# Altium schematic sheet Main.SchDoc
size 381 x 241 mm; SheetNumber: 1; SheetTotal: 13
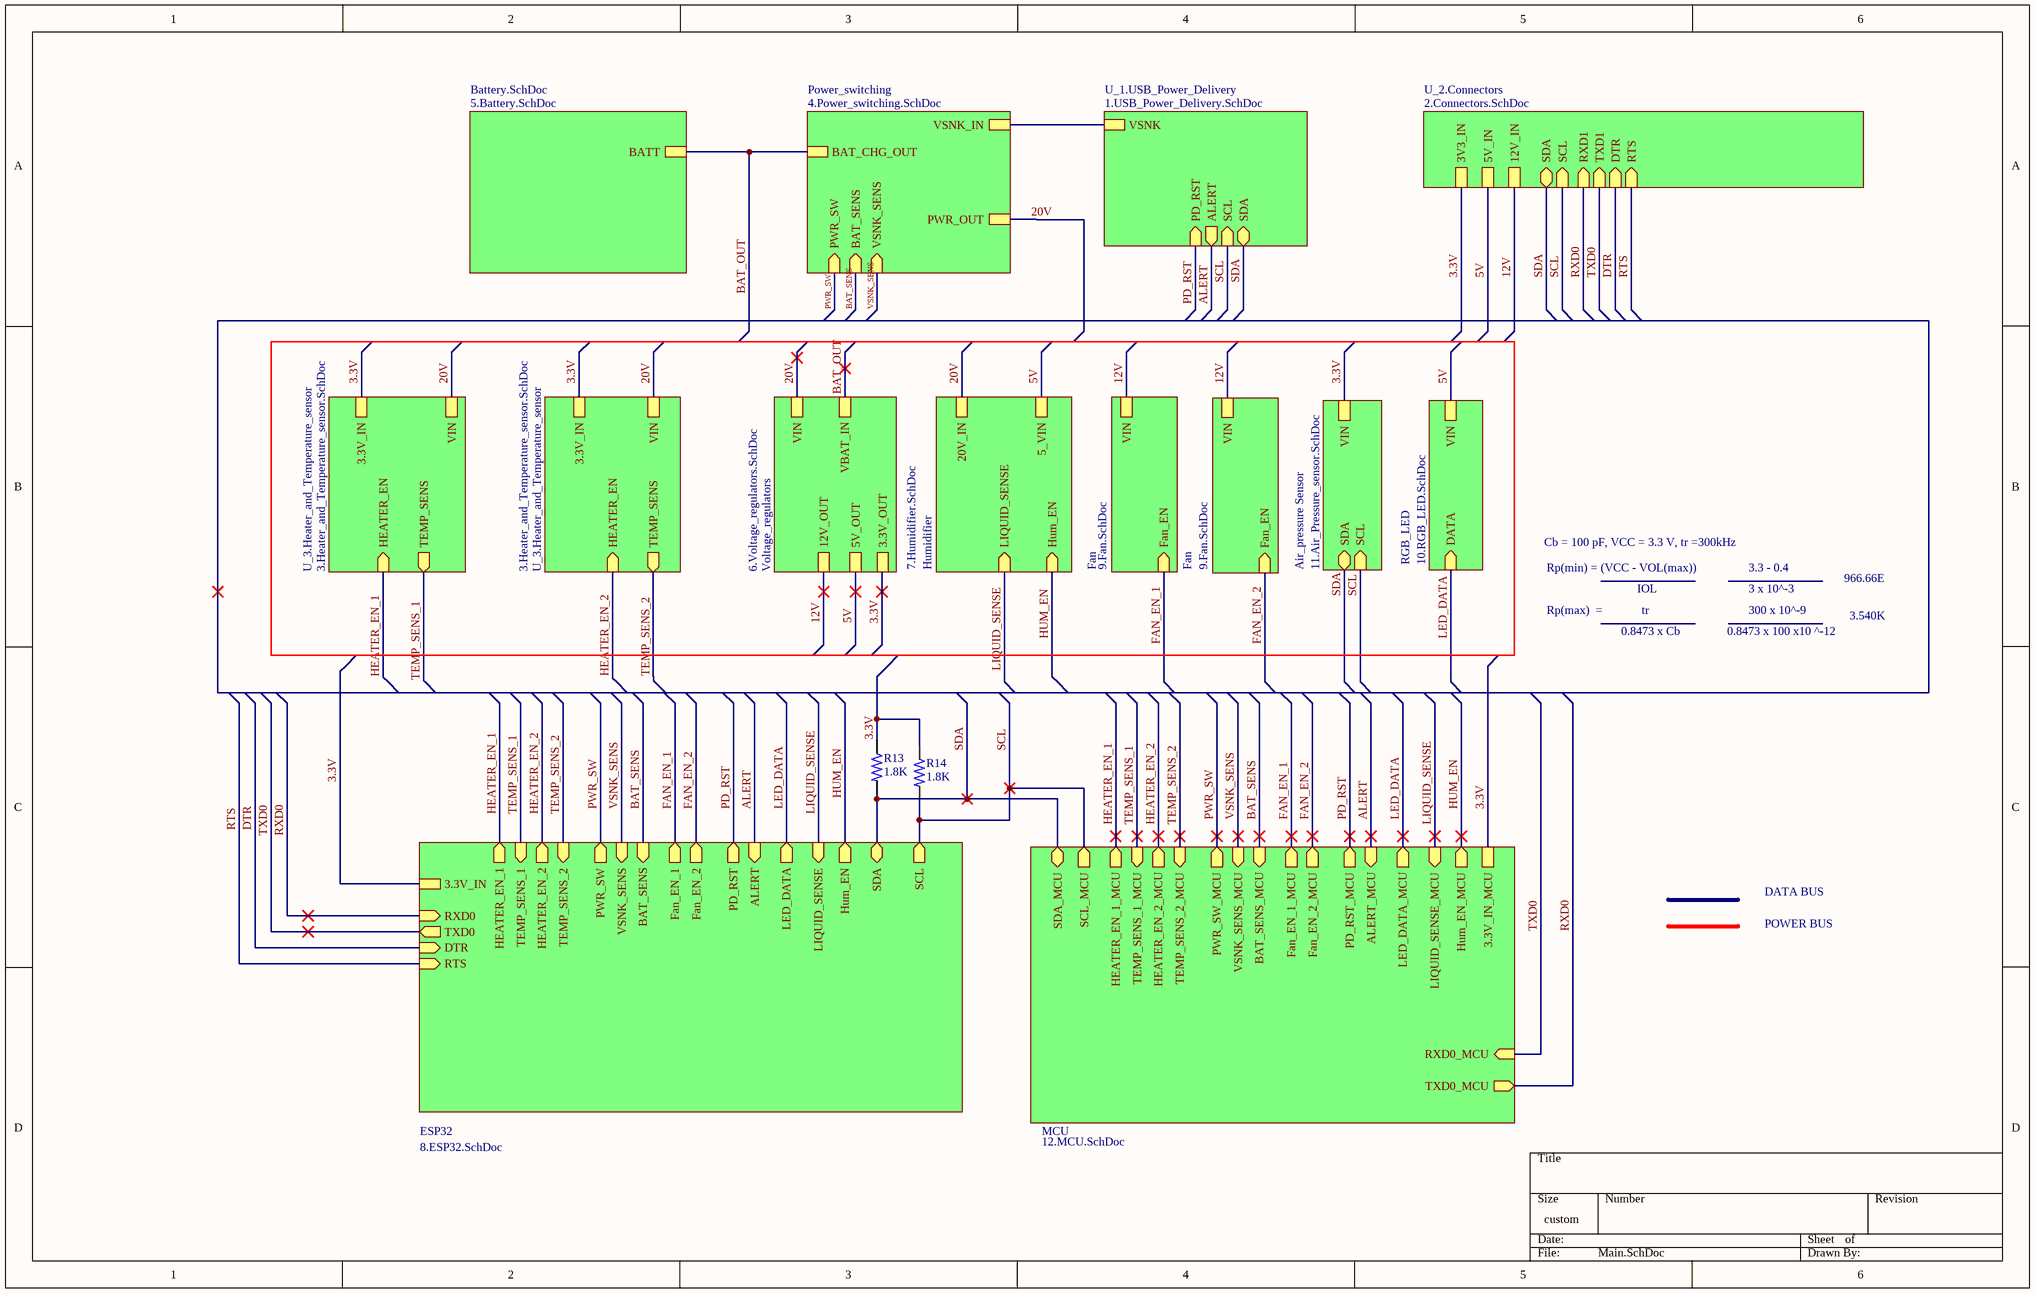
[diagram p0: Main.SchDoc]

## Parts
R13  1.8K  [R_0603]
R14  1.8K  [R_0603]

## Sub-sheets
Air_pressure Sensor = 11.Air_Pressure_sensor.SchDoc: VIN, SDA (bidir), SCL (in)
Battery.SchDoc = 5.Battery.SchDoc: BATT
ESP32 = 8.ESP32.SchDoc: SDA (bidir), SCL (out), 3.3V_IN, Hum_EN (out), RXD0 (in), TXD0 (out), DTR (in), RTS (in), HEATER_EN_1 (out), TEMP_SENS_1 (in), HEATER_EN_2 (out), TEMP_SENS_2 (in), LIQUID_SENSE (in), Fan_EN_1 (out), LED_DATA (out), Fan_EN_2 (out), PWR_SW (out), VSNK_SENS (in), BAT_SENS (in), PD_RST (out), ALERT (in)
Fan = 9.Fan.SchDoc: VIN, Fan_EN (in)
Fan = 9.Fan.SchDoc: VIN, Fan_EN (in)
Humidifier = 7.Humidifier.SchDoc: Hum_EN (in), 5_VIN, 20V_IN, LIQUID_SENSE (in)
MCU = 12.MCU.SchDoc: SDA_MCU (bidir), SCL_MCU (out), Hum_EN_MCU (out), HEATER_EN_2_MCU (out), TEMP_SENS_2_MCU (in), LIQUID_SENSE_MCU (in), Fan_EN_1_MCU (out), LED_DATA_MCU (out), Fan_EN_2_MCU (out), PWR_SW_MCU (out), VSNK_SENS_MCU (in), BAT_SENS_MCU (in), PD_RST_MCU (out), ALERT_MCU (in), RXD0_MCU (in), TXD0_MCU (out), 3.3V_IN_MCU, HEATER_EN_1_MCU (out), TEMP_SENS_1_MCU (in)
Power_switching = 4.Power_switching.SchDoc: PWR_OUT, VSNK_IN, BAT_CHG_OUT, PWR_SW (in), BAT_SENS (in), VSNK_SENS (in)
RGB_LED = 10.RGB_LED.SchDoc: DATA (in), VIN
U_1.USB_Power_Delivery = 1.USB_Power_Delivery.SchDoc: SDA (bidir), SCL (in), ALERT (out), PD_RST (in), VSNK
U_2.Connectors = 2.Connectors.SchDoc: SDA (bidir), SCL (in), RXD1 (in), TXD1 (in), DTR (in), RTS (in), 5V_IN, 3V3_IN, 12V_IN
U_3.Heater_and_Temperature_sensor = 3.Heater_and_Temperature_sensor.SchDoc: HEATER_EN (in), VIN, TEMP_SENS (out), 3.3V_IN
U_3.Heater_and_Temperature_sensor = 3.Heater_and_Temperature_sensor.SchDoc: HEATER_EN (in), VIN, TEMP_SENS (out), 3.3V_IN
Voltage_regulators = 6.Voltage_regulators.SchDoc: VIN, 3.3V_OUT, VBAT_IN, 5V_OUT, 12V_OUT

## Nets
3.3V: R13.1 R14.1 ; sheet U_2.Connectors/3V3_IN, sheet U_3.Heater_and_Temperature_sensor/3.3V_IN, sheet U_3.Heater_and_Temperature_sensor/3.3V_IN, sheet Air_pressure Sensor/VIN, sheet Voltage_regulators/3.3V_OUT, sheet ESP32/3.3V_IN, sheet MCU/3.3V_IN_MCU
5V: sheet U_2.Connectors/5V_IN, sheet Humidifier/5_VIN, sheet Voltage_regulators/5V_OUT, sheet RGB_LED/VIN
12V: sheet U_2.Connectors/12V_IN, sheet Fan/VIN, sheet Voltage_regulators/12V_OUT, sheet Fan/VIN
20V: sheet U_3.Heater_and_Temperature_sensor/VIN, sheet U_3.Heater_and_Temperature_sensor/VIN, sheet Power_switching/PWR_OUT, sheet Humidifier/20V_IN, sheet Voltage_regulators/VIN
ALERT: sheet U_1.USB_Power_Delivery/ALERT, sheet ESP32/ALERT, sheet MCU/ALERT_MCU
BAT_OUT: sheet Power_switching/BAT_CHG_OUT, sheet Battery.SchDoc/BATT, sheet Voltage_regulators/VBAT_IN
BAT_SENS: sheet Power_switching/BAT_SENS, sheet ESP32/BAT_SENS, sheet MCU/BAT_SENS_MCU
DTR: sheet U_2.Connectors/DTR, sheet ESP32/DTR
FAN_EN_1: sheet Fan/Fan_EN, sheet ESP32/Fan_EN_1, sheet MCU/Fan_EN_1_MCU
FAN_EN_2: sheet ESP32/Fan_EN_2, sheet Fan/Fan_EN, sheet MCU/Fan_EN_2_MCU
HEATER_EN_1: sheet U_3.Heater_and_Temperature_sensor/HEATER_EN, sheet ESP32/HEATER_EN_1, sheet MCU/HEATER_EN_1_MCU
HEATER_EN_2: sheet U_3.Heater_and_Temperature_sensor/HEATER_EN, sheet ESP32/HEATER_EN_2, sheet MCU/HEATER_EN_2_MCU
HUM_EN: sheet Humidifier/Hum_EN, sheet ESP32/Hum_EN, sheet MCU/Hum_EN_MCU
LED_DATA: sheet ESP32/LED_DATA, sheet RGB_LED/DATA, sheet MCU/LED_DATA_MCU
LIQUID_SENSE: sheet Humidifier/LIQUID_SENSE, sheet ESP32/LIQUID_SENSE, sheet MCU/LIQUID_SENSE_MCU
PD_RST: sheet U_1.USB_Power_Delivery/PD_RST, sheet ESP32/PD_RST, sheet MCU/PD_RST_MCU
PWR_SW: sheet Power_switching/PWR_SW, sheet ESP32/PWR_SW, sheet MCU/PWR_SW_MCU
RTS: sheet U_2.Connectors/RTS, sheet ESP32/RTS
RXD0: sheet U_2.Connectors/RXD1, sheet ESP32/RXD0, sheet MCU/TXD0_MCU
SCL: R14.2 ; sheet U_1.USB_Power_Delivery/SCL, sheet U_2.Connectors/SCL, sheet Air_pressure Sensor/SCL, sheet ESP32/SCL, sheet MCU/SCL_MCU
SDA: R13.2 ; sheet U_1.USB_Power_Delivery/SDA, sheet U_2.Connectors/SDA, sheet Air_pressure Sensor/SDA, sheet ESP32/SDA, sheet MCU/SDA_MCU
TEMP_SENS_1: sheet U_3.Heater_and_Temperature_sensor/TEMP_SENS, sheet ESP32/TEMP_SENS_1, sheet MCU/TEMP_SENS_1_MCU
TEMP_SENS_2: sheet U_3.Heater_and_Temperature_sensor/TEMP_SENS, sheet ESP32/TEMP_SENS_2, sheet MCU/TEMP_SENS_2_MCU
TXD0: sheet U_2.Connectors/TXD1, sheet ESP32/TXD0, sheet MCU/RXD0_MCU
VSNK_SENS: sheet Power_switching/VSNK_SENS, sheet ESP32/VSNK_SENS, sheet MCU/VSNK_SENS_MCU
(unnamed): sheet U_1.USB_Power_Delivery/VSNK, sheet Power_switching/VSNK_IN

## Notes on the sheet
- Cb = 100 pF, VCC = 3.3 V, tr =300kHz
- Rp(min) = (VCC - VOL(max))
- 3.3 - 0.4
- Rp(max)  =             tr
- 0.8473 x Cb
- IOL
- 0.8473 x 100 x10 ^-12
- 300 x 10^-9
- 3 x 10^-3
- 966.66E
- 3.540K
- DATA BUS
- POWER BUS

## Library data of the parts
R13 R14 = R_0603: D: *; MFR: *; P: *; PN: *; URL: *